# Altium schematic sheet Sheet5.SchDoc
size B
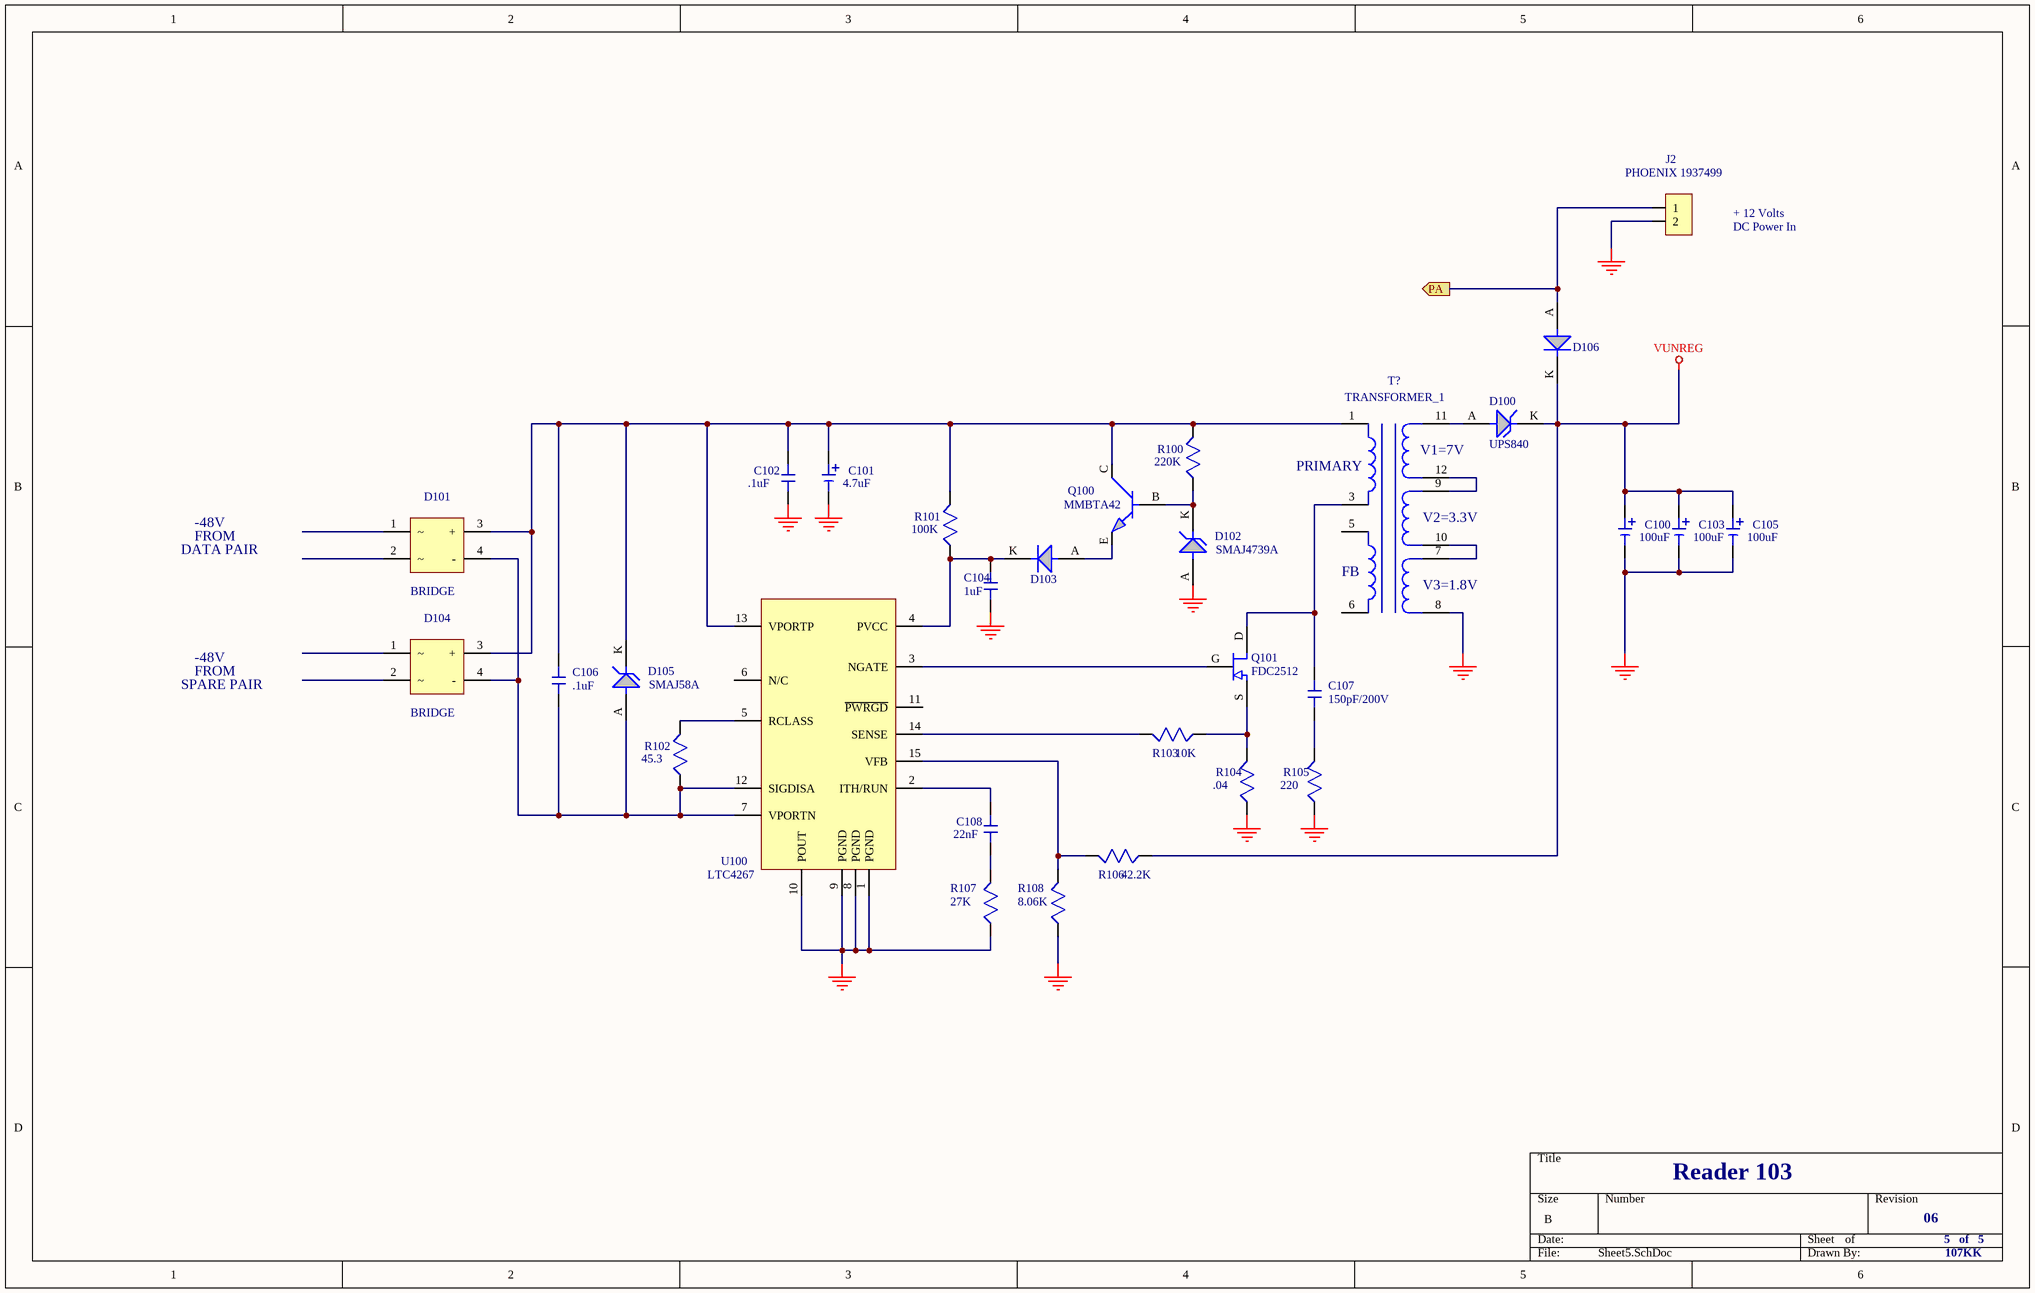
[diagram p0: Sheet5.SchDoc]

## Parts
C100  100uF  [CAP D CASE_030205]
C101  4.7uF  [CAP A CASE_030205]
C102  .1uF  [0603_072205]
C103  100uF  [CAP D CASE_030205]
C104  1uF  [0603_072205]
C105  100uF  [CAP D CASE_030205]
C106  .1uF
C107  150pF/200V  [0805_011905]
C108  22nF  [0603_072205]
D100  UPS840  [POWERMITE-3_011207]
D101  BRIDGE
D102  SMAJ4739A  [DIODE SMA_0120907]
D103  BAS516  [SOD523_093005]  (value not drawn)
D104  BRIDGE
D105  SMAJ58A  [DIODE SMA_0120907]
D106  S1B  [DIODE SMB_012005]  (value not drawn)
J2  PHOENIX 1937499  [CONN PHOENIX 1803227-2]
Q100  MMBTA42  [SOT23 TRANS_011905]
Q101  FDC2512  [SUPER SOT-6 FET_011207]
R100  220K  [0603_072205]
R101  100K  [0603_072205]
R102  45.3  [0603_072205]
R103  10K  [0603_072205]
R104  .04  [0603_072205]
R105  220  [0603_072205]
R106  42.2K  [0603_072205]
R107  27K  [0603_072205]
R108  8.06K  [0603_072205]
T?  TRANSFORMER_1
U100  LTC4267

## Ports
PA (out)

## Nets
GND_COM: C100.2 C101.2 C102.2 C103.2 C104.2 C105.2 D102.A J2.2 R104.2 R105.2 R107.2 R108.2 T?.8 U100.1(PGND) U100.8(PGND) U100.9(PGND) U100.10(POUT)
VUNREG: C100.1 C103.1 C105.1 D100.K D106.K R106.2
PA: D106.A J2.1 ; port PA
NetC101_1: C101.1 C102.1 C106.1 D101.3(+) D104.3(+) D105.K Q100.C R100.1 R101.1 T?.1 U100.13(VPORTP)
NetC104_1: C104.1 D103.K R101.2 U100.4(PVCC)
NetC106_2: C106.2 D101.4(-) D104.4(-) D105.A R102.2 U100.7(VPORTN) U100.12(SIGDISA)
NetC107_1: C107.1 Q101.D T?.3
NetC107_2: C107.2 R105.1
NetC108_1: C108.1 U100.2(ITH/RUN)
NetC108_2: C108.2 R107.1
NetD100_A: D100.A T?.11
NetD102_K: D102.K Q100.B R100.2
NetD103_A: D103.A Q100.E
NetQ101_G: Q101.G U100.3(NGATE)
NetQ101_S: Q101.S R103.2 R104.1
NetR102_1: R102.1 U100.5(RCLASS)
NetR103_1: R103.1 U100.14(SENSE)
NetR106_1: R106.1 R108.1 U100.15(VFB)
NetT?_7: T?.7 T?.10
NetT?_9: T?.9 T?.12

Not connected (* = marked no-connect by the designer): D101 1(~) 2(~); D104 1(~) 2(~); T? 5 6; U100 6(N/C) 11(~{PWRGD})

## Notes on the sheet
- + 12 Volts
- DC Power In
- (near T?) PRIMARY
- (near T?) V1=7V
- DATA PAIR
- -48V
- FROM
- (near T?) V2=3.3V
- (near T?) FB
- (near T?) V3=1.8V
- SPARE PAIR
- Reader 103
- 06
- 5   of   5
- 107KK

## Library data of the parts
C100 C101 C103 C105 = CAP POL: PARTNO: *
  C100 C103 C105: VALUE: 100uF
  C101: VALUE: 4.7uF
C102 C104 C106-C108 = CAP NP: PARTNO: *
  C102 C106: VALUE: .1uF
  C104: VALUE: 1uF
  C107: VALUE: 150pF/200V
  C108: VALUE: 22nF
D100 D102 D105 = DIODE_ZENER: PARTNO: *
  D100: VALUE: UPS840
  D102: VALUE: SMAJ4739A
  D105: VALUE: SMAJ58A
D103 D106 = DIODE: PARTNO: *
  D103: VALUE: BAS516
  D106: VALUE: S1B
J2 = CON2: Connector
Q100 = NPN: PARTNO: *; VALUE: MMBTA42
Q101 = FET N CHANNEL: PARTNO: *; VALUE: FDC2512
R100-R108 = RESISTOR: PARTNO: *
  R100: VALUE: 220K
  R101: VALUE: 100K
  R102: VALUE: 45.3
  R103: VALUE: 10K
  R104: VALUE: .04
  R105: VALUE: 220
  R106: VALUE: 42.2K
  R107: VALUE: 27K
  R108: VALUE: 8.06K
D101 D104 = BRIDGE: PARTNO: *; VALUE: *
T? = TRANSFORMER_1: PARTNO: *; VALUE: *